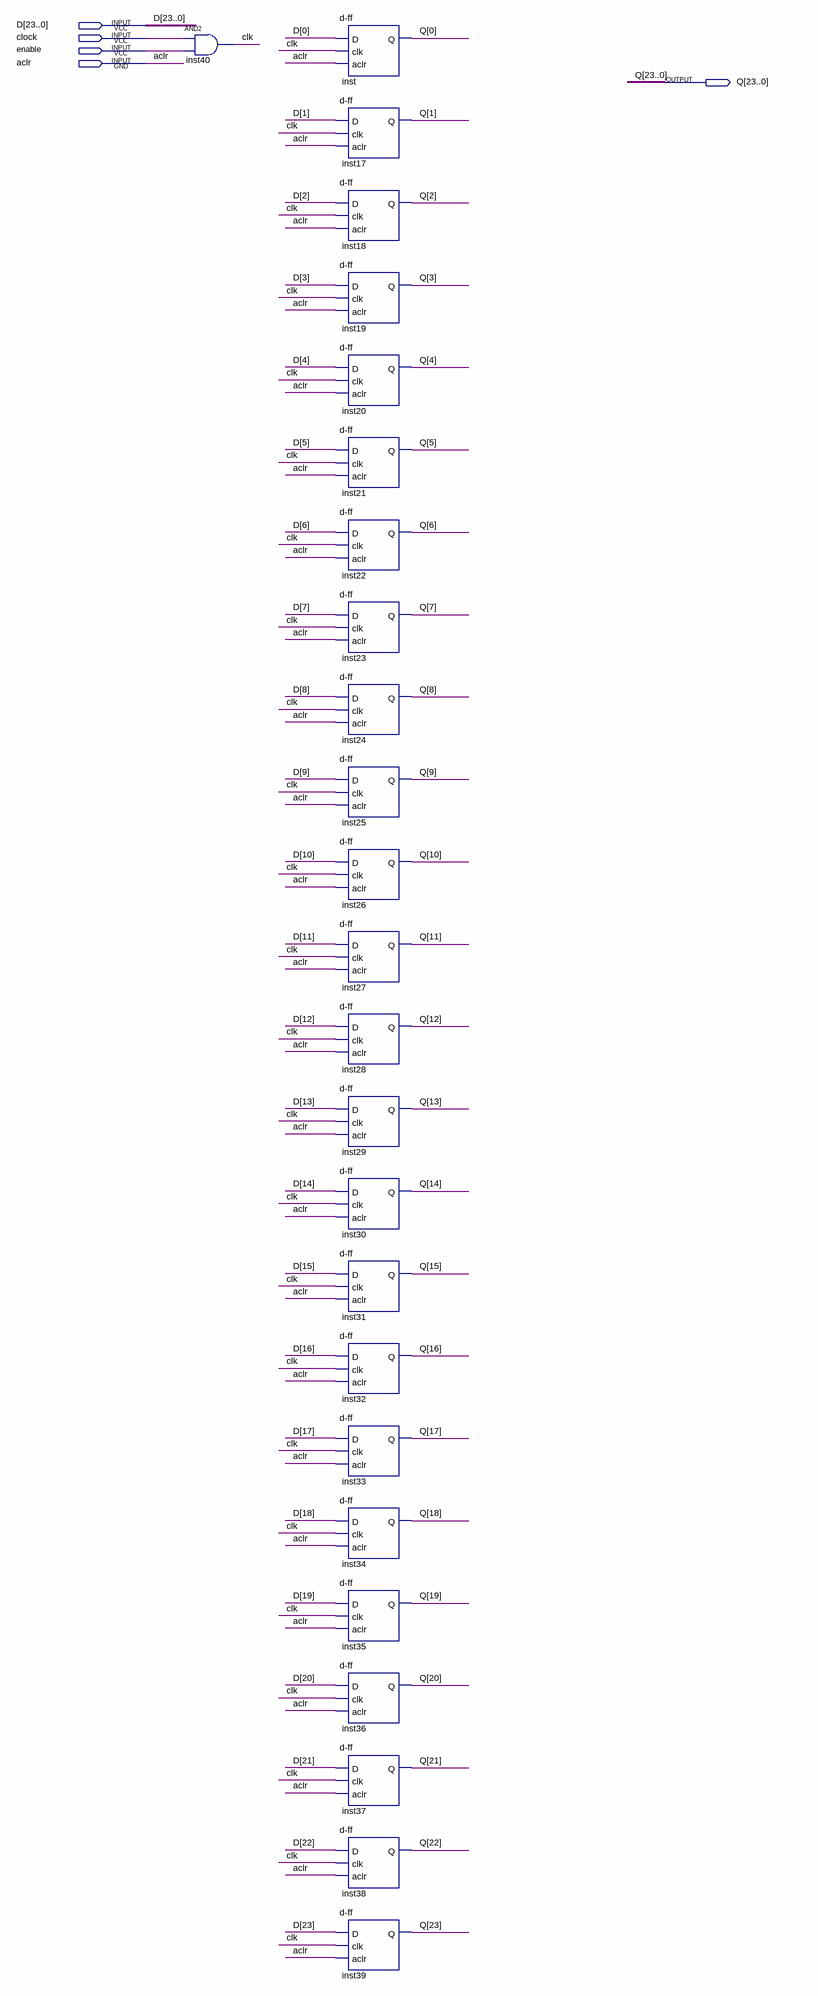
[diagram p0: schematic sheet]
// Quartus schematic DFF_24BIT.bdf as structural Verilog: 25 symbols, 5 pins
module DFF_24BIT (
  input  [23:0] D,
  input  clock,
  input  enable,
  input  aclr,
  output [23:0] Q
);

  wire clk;

  and inst40 (clk, clock, enable);
  \d-ff  inst (.D(D[0]), .clk(clk), .aclr(aclr), .Q(Q[0]));
  \d-ff  inst17 (.D(D[1]), .clk(clk), .aclr(aclr), .Q(Q[1]));
  \d-ff  inst18 (.D(D[2]), .clk(clk), .aclr(aclr), .Q(Q[2]));
  \d-ff  inst19 (.D(D[3]), .clk(clk), .aclr(aclr), .Q(Q[3]));
  \d-ff  inst20 (.D(D[4]), .clk(clk), .aclr(aclr), .Q(Q[4]));
  \d-ff  inst21 (.D(D[5]), .clk(clk), .aclr(aclr), .Q(Q[5]));
  \d-ff  inst22 (.D(D[6]), .clk(clk), .aclr(aclr), .Q(Q[6]));
  \d-ff  inst23 (.D(D[7]), .clk(clk), .aclr(aclr), .Q(Q[7]));
  \d-ff  inst24 (.D(D[8]), .clk(clk), .aclr(aclr), .Q(Q[8]));
  \d-ff  inst25 (.D(D[9]), .clk(clk), .aclr(aclr), .Q(Q[9]));
  \d-ff  inst26 (.D(D[10]), .clk(clk), .aclr(aclr), .Q(Q[10]));
  \d-ff  inst27 (.D(D[11]), .clk(clk), .aclr(aclr), .Q(Q[11]));
  \d-ff  inst28 (.D(D[12]), .clk(clk), .aclr(aclr), .Q(Q[12]));
  \d-ff  inst29 (.D(D[13]), .clk(clk), .aclr(aclr), .Q(Q[13]));
  \d-ff  inst30 (.D(D[14]), .clk(clk), .aclr(aclr), .Q(Q[14]));
  \d-ff  inst31 (.D(D[15]), .clk(clk), .aclr(aclr), .Q(Q[15]));
  \d-ff  inst32 (.D(D[16]), .clk(clk), .aclr(aclr), .Q(Q[16]));
  \d-ff  inst33 (.D(D[17]), .clk(clk), .aclr(aclr), .Q(Q[17]));
  \d-ff  inst34 (.D(D[18]), .clk(clk), .aclr(aclr), .Q(Q[18]));
  \d-ff  inst35 (.D(D[19]), .clk(clk), .aclr(aclr), .Q(Q[19]));
  \d-ff  inst36 (.D(D[20]), .clk(clk), .aclr(aclr), .Q(Q[20]));
  \d-ff  inst37 (.D(D[21]), .clk(clk), .aclr(aclr), .Q(Q[21]));
  \d-ff  inst38 (.D(D[22]), .clk(clk), .aclr(aclr), .Q(Q[22]));
  \d-ff  inst39 (.D(D[23]), .clk(clk), .aclr(aclr), .Q(Q[23]));
endmodule
